# EAGLE design Precharge_M2019_V1.0 (EAGLE 9.1.1)
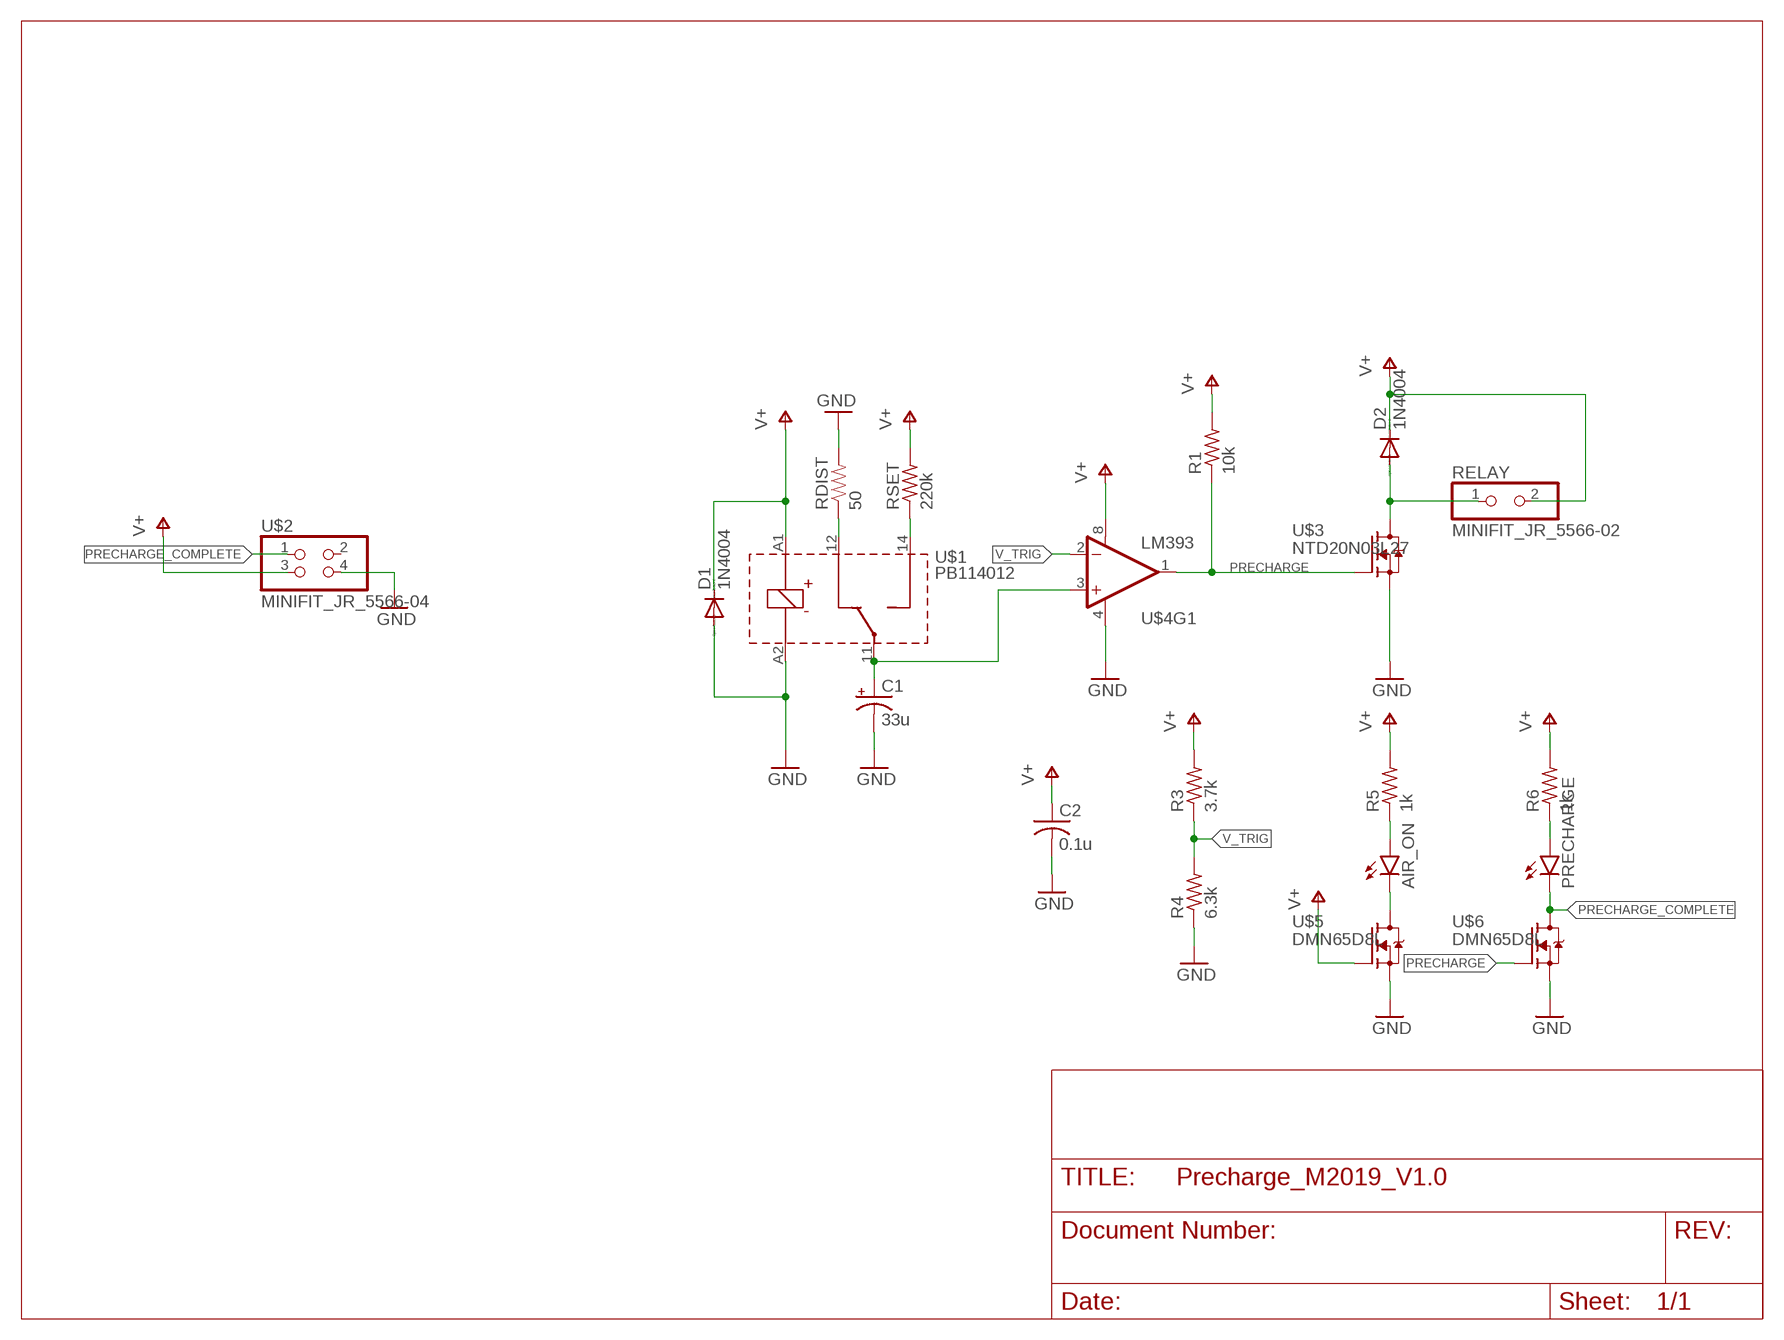
[diagram p0: schematic, sheet 1]

## Parts
AIR_ON  LED0603  [LED-0603]
C1  33u  CPOL-USE2.5-5  [E2,5-5]
C2  0.1u  C-USC0805  [C0805]
D1  1N4004  [DO41-10]
D2  1N4004  [DO41-10]
PRECHARGE  LED0603  [LED-0603]
R1  10k  R-US_R0805  [R0805]
R3  3.7k  R-US_R0805  [R0805]
R4  6.3k  R-US_R0805  [R0805]
R5  1k  R-US_R0805  [R0805]
R6  1k  R-US_R0805  [R0805]
RDIST  50  RESISTORPTH-1/2W  [AXIAL-0.5]
RELAY  MINIFIT_JR_5566-02  [MINIFIT_JR_5566-02]
RSET  220k  R-US_0207/10  [0207/10]
U$1  PB114012  [TH_SPDT_MINI_POWER_RELAY_PB]
U$2  MINIFIT_JR_5566-04  [MINIFIT_JR_5566-04]
U$3  NTD20N03L27  [DPACK]
U$4  LM393  [SO08]
U$5  DMN65D8L  [SOT23]
U$6  DMN65D8L  [SOT23]

## Nets
GND: C1.- C2.2 D1.A R4.1 RDIST.P$2 U$1.A2(COIL-) U$2.4 U$3.3(S) U$4.4(V-) U$5.2(S) U$6.2(S)
N$1: RSET.1 U$1.14(NO)
N$2: C1.+ U$1.11(COM) U$4.3(+IN)
N$3: RDIST.P$1 U$1.12(NC)
N$4: D2.A RELAY.1 U$3.2(D)
N$5: AIR_ON.A R5.1
N$6: PRECHARGE.A R6.1
N$9: AIR_ON.C U$5.3(D)
PRECHARGE: R1.1 U$3.1(G) U$4.1(OUT) U$6.1(G)
PRECHARGE_COMPLETE: PRECHARGE.C U$2.1 U$6.3(D)
V+: C2.1 D1.C D2.C R1.2 R3.2 R5.2 R6.2 RELAY.2 RSET.2 U$1.A1(COIL+) U$2.3 U$4.8(V+) U$5.1(G)
V_TRIG: R3.1 R4.2 U$4.2(-IN)
Unconnected: U$2.2 U$4.5(+IN) U$4.6(-IN) U$4.7(OUT)

## Library data of the parts
AIR_ON PRECHARGE = SparkFun-LED:LED: LEDs Standard schematic elements and footprints for 5mm, 3mm, 1206, and 0603 sized LEDs. 5mm - Spark Fun Electronics SKU : COM-00529 (and others)
C1 = rcl:CPOL-US: POLARIZED CAPACITOR, American symbol; SPICEPREFIX: C
C2 = resistor:C-US: CAPACITOR, American symbol
D1 D2 = Diodes_IFE:1N4004: DIODE general purpose rectifier, 1 A
R1 R3-R6 RSET = rcl:R-US_: RESISTOR, American symbol; SPICEPREFIX: R
RDIST = SparkFun-Resistors:RESISTOR: Resistor Basic schematic elements and footprints for 0603, 1206, and PTH resistors.
RELAY = Display_Custom:MINIFIT_JR_5566-02: Molex Minifit JR 5566-02 Vertical 2 position headder https://www.molex.com/pdm_docs/sd/039293026_sd.pdf
U$1 = Display_Custom:PB114012: PB114012 TE Connectivity Mini Power Pelay SPDT http://www.te.com/commerce/DocumentDelivery/DDEController?Action=srchrtrv&DocNm=PB&DocType=DS&DocLang=English
U$2 = Display_Custom:MINIFIT_JR_5566-04: Molex Minifit JR 5566-04 Vertical 4 position headder https://www.molex.com/pdm_docs/sd/039293026_sd.pdf
U$3 = Display_Custom:NTD20N03L27: ON-Semi 30V 20A Mosfet https://media.digikey.com/pdf/Data%20Sheets/ON%20Semiconductor%20PDFs/NTD20N03L27,NVD20N03L27.pdf
U$4 = SparkFun-AnalogIC:LM393: Low-voltage comparator
U$5 U$6 = Display_Custom:DMN65D8L: 60V N-Channel Mosfet SOT23 https://www.diodes.com/assets/Datasheets/DMN65D8L.pdf

## Board
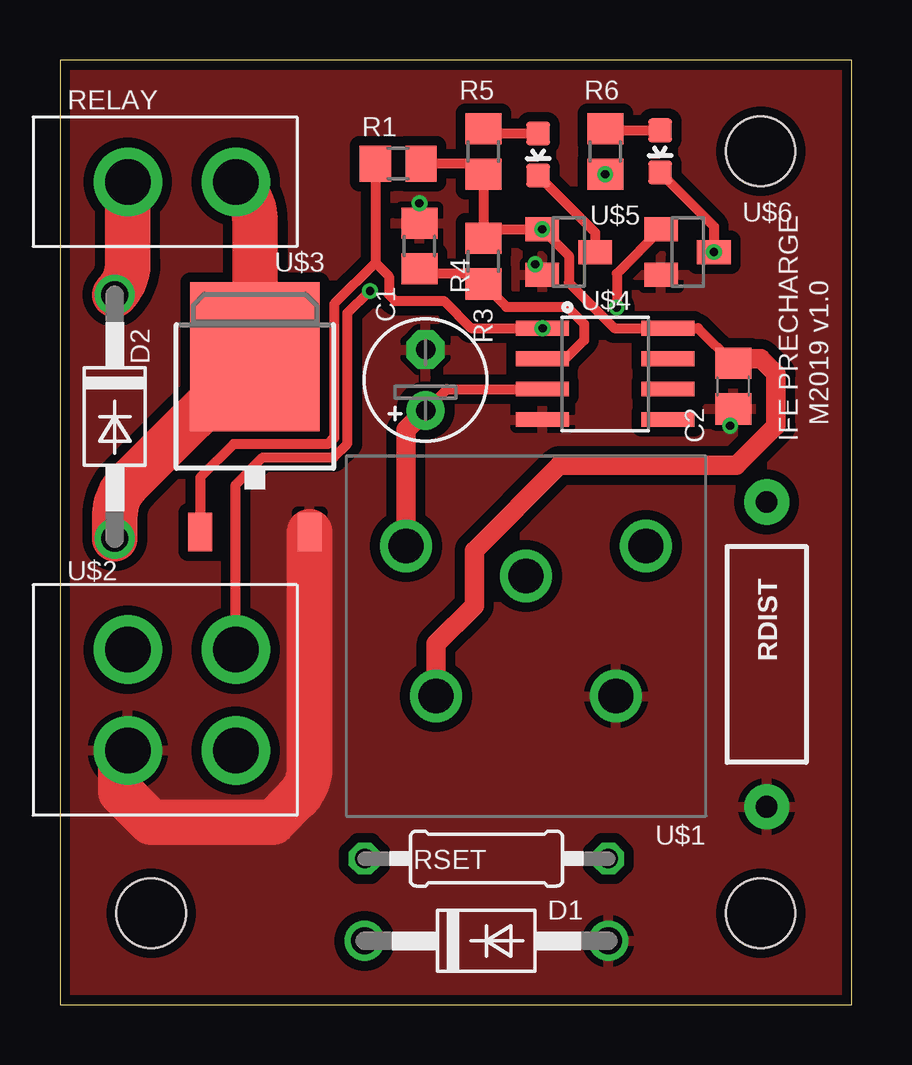
[diagram p1: board, top side]
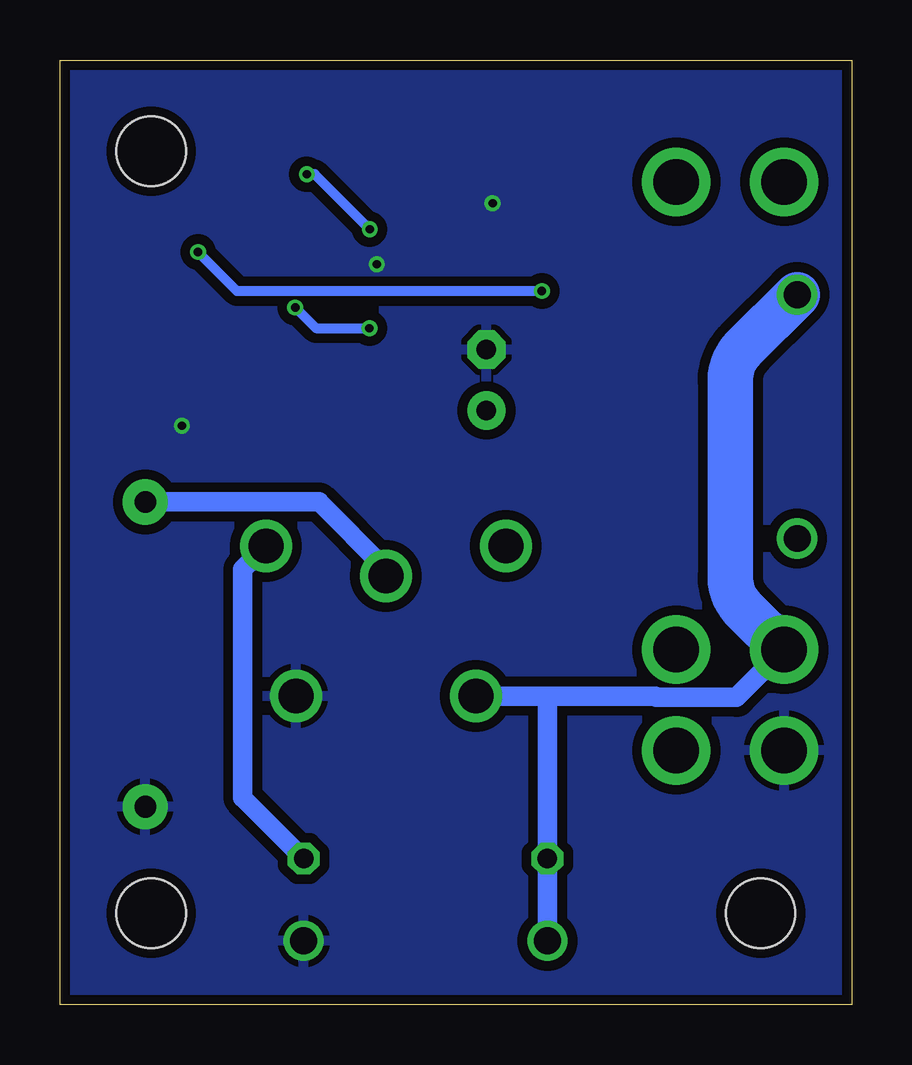
[diagram p2: board, bottom side, seen from below]

Size 33.02 x 39.37 mm. Coordinates in mm from the lower left corner, seen from the top.
Outline: 0,0 33.02,0 33.02,39.37 0,39.37 0,0
Copper layers (1*16): Top 0.035mm / dielectric 1.5mm / Bottom 0.035mm
Design rules "SeeedStudio_2layer_DRU_no_angle_20140221": minimum track width 6mil, minimum drill 12mil, track to track 6mil, track to pad 6mil, pad to pad 6mil, via to via 6mil, smd to smd 0mil, copper to edge 10mil, drill to drill 10mil, minimum pad ring 10mil, minimum via ring 6mil, stop-mask expansion 2mil, vias tented up to drill 100mil, thermal gap 10mil
Holes 2.9 mm at 3.81,3.81 29.21,3.81 29.21,35.56

### Footprints (pad centres in the part's own frame; a part is rotated, then mirrored left to right if it is on the bottom)
LED-0603 = smd 1 x 1: A 0,-0.877; C 0,0.877
E2,5-5 = drill 0.813 pad 1.6: + -1.27,0 | drill 0.813 pad 1.6 octagon: - 1.27,0
C0805 = smd 1.3 x 1.5: 1 -0.95,0; 2 0.95,0
DO41-10 = drill 1.118: A 5.08,0; C -5.08,0
R0805 = smd 1.3 x 1.5: 1 -0.95,0; 2 0.95,0
AXIAL-0.5 = drill 0.9 pad 1.88: P$1 -6.35,0; P$2 6.35,0
MINIFIT_JR_5566-02 = drill 1.9: 1 0,2.25; 2 0,-2.25
0207/10 = drill 0.813 octagon: 1 -5.08,0; 2 5.08,0
TH_SPDT_MINI_POWER_RELAY_PB = drill 1.45: 11 3.75,5; 12 2.5,0; 14 3.75,-5; A1 -2.5,3.75; A2 -2.5,-3.75
MINIFIT_JR_5566-04 = drill 1.9: 1 -2.1,2.25; 2 2.1,2.25; 3 -2.1,-2.25; 4 2.1,-2.25
DPACK = smd 1 x 1.6: 1 -2.28,-4.8; 3 2.28,-4.8 | smd 5.4 x 6.2: 2 0,2.5
SO08 = smd 0.61 x 2.21: 1 -1.905,-2.616; 2 -0.635,-2.616; 3 0.635,-2.616; 4 1.905,-2.616; 5 1.905,2.616; 6 0.635,2.616; 7 -0.635,2.616; 8 -1.905,2.616
SOT23 = smd 1 x 1.4: 1 -0.95,-1.1; 2 0.95,-1.1; 3 0,1.1

### Placement (x,y rotation side)
AIR_ON  19.94,35.43 180 top
C1  15.24,26.04 90 top
C2  28.07,25.78 270 top
D1  17.78,2.67 0 top
D2  2.29,24.51 270 top
PRECHARGE  25.02,35.56 180 top
R1  14.1,35.05 0 top
R3  17.65,30.99 90 top
R4  14.99,31.62 270 top
R5  17.65,35.56 270 top
R6  22.73,35.56 270 top
RDIST  29.46,14.61 270 top
RELAY  5.08,34.29 270 top
RSET  17.78,6.1 180 top
U$1  19.43,15.37 90 top
U$2  5.08,12.7 270 top
U$3  8.13,24.51 0 top
U$4  22.73,26.29 270 top
U$5  21.21,31.37 270 top
U$6  26.16,31.37 270 top

### Tracks (layer width: path | path; a pad name or v marks a point on that pad's centre or on a via)
GND  (via drill 0.35)
  Top 0.406: v27.94,24.13 28.07,24.26 C2.2
  Top 1.905: U$3.3 10.41,9.93 arc-45 9.85,8.58 8.89,7.62 3.81,7.62 2.54,8.89 2.54,9.9 arc-45 U$2.4
  other vias: 14.99,33.4 19.81,30.86
  pour Top (isolate 0.406): 0,39.37 0,0 33.02,0 33.02,39.37
  pour Bottom (isolate 0.406): 0,39.37 0,0 33.02,0 33.02,39.37
N$1
  Bottom 0.813: U$1.14 25.4,18.15 25.4,8.64 RSET.1
N$2
  Top 0.406: C1.+ 16.13,25.65 U$4.3
  Top 0.813: U$1.11 14.43,23.96 C1.+
N$3
  Bottom 0.813: RDIST.P$1 22.23,20.95 19.43,18.16 U$1.12
N$4
  Top 1.905: RELAY.1 7.57,34.05 arc-45 8.13,32.7 U$3.2 2.84,21.73 arc45 2.29,20.38 D2.A
N$5
  Top 0.406: R5.1 17.85,36.31 AIR_ON.A
N$6
  Top 0.406: R6.1 22.81,36.44 PRECHARGE.A
N$9
  Top 0.406: AIR_ON.C 22.31,32.19 U$5.3
PRECHARGE  (via drill 0.35)
  Top 0.406: R1.1 13.15,30.93 | 13.15,30.93 11.43,29.21 11.43,23.62 11.18,23.37 7.24,23.37 5.85,21.98 U$3.1 | 13.15,30.93 13.72,30.36 13.72,29.59 13.97,29.34 16,29.34 17.14,28.19 U$4.1 | U$6.1 23.21,30.47 v23.21,29.06
  Bottom 0.406: v23.21,29.06 22.35,28.19 U$4.1
  other vias: 20.12,28.19
PRECHARGE_COMPLETE  (via drill 0.35)
  Top 0.406: PRECHARGE.C 27.26,32.44 U$6.3 | U$2.1 7.33,21.68 8.46,22.81 11.41,22.81 11.99,23.39 11.99,28.83 12.9,29.74 v12.93,29.74
  Bottom 0.406: v12.93,29.74 25.64,29.74 U$6.3
  other vias: 27.26,31.37
V+  (via drill 0.35)
  Top 0.406: C2.1 26.6,28.19 U$4.8 23.11,28.19 21.21,30.1 21.21,31.22 U$5.1 18.03,32.32 R3.2 R5.2 17.21,35.05 R1.2
  Top 0.813: U$1.A1 15.68,15.05 17.27,16.64 17.27,18.92 20.83,22.48 28.19,22.48 29.84,24.13 29.84,26.29 29.21,26.92 28.26,26.92 C2.1
  Top 1.905: D2.C arc45 2.83,30.9 RELAY.2
  Bottom 0.406: U$5.1 22.4,34.61 R6.2
  Bottom 0.813: 12.7,12.87 8.2,12.87 8.15,12.82 4.81,12.82 U$2.3 | 12.7,12.87 U$1.A1 | 12.7,12.87 RSET.2 D1.C
  Bottom 1.905: D2.C 4.52,27.36 arc-45 5.08,26.01 5.08,17.84 arc-45 4.52,16.49 U$2.3
  other vias: 20.11,32.32 22.73,34.61
V_TRIG
  Top 0.406: R4.2 15.18,30.48 17.21,30.48 R3.1 18.61,29.08 21.14,29.08 21.84,28.38 21.84,27.69 21.08,26.92 U$4.2

### Text on the board
tNames: IFE PRECHARGE | M2019 v1.0